# EasyEDA schematic My_Own_Arduino.json
TITLE: Dev Board; REV: 1.0; Date: 2020-12-23; Sheet: 1/1
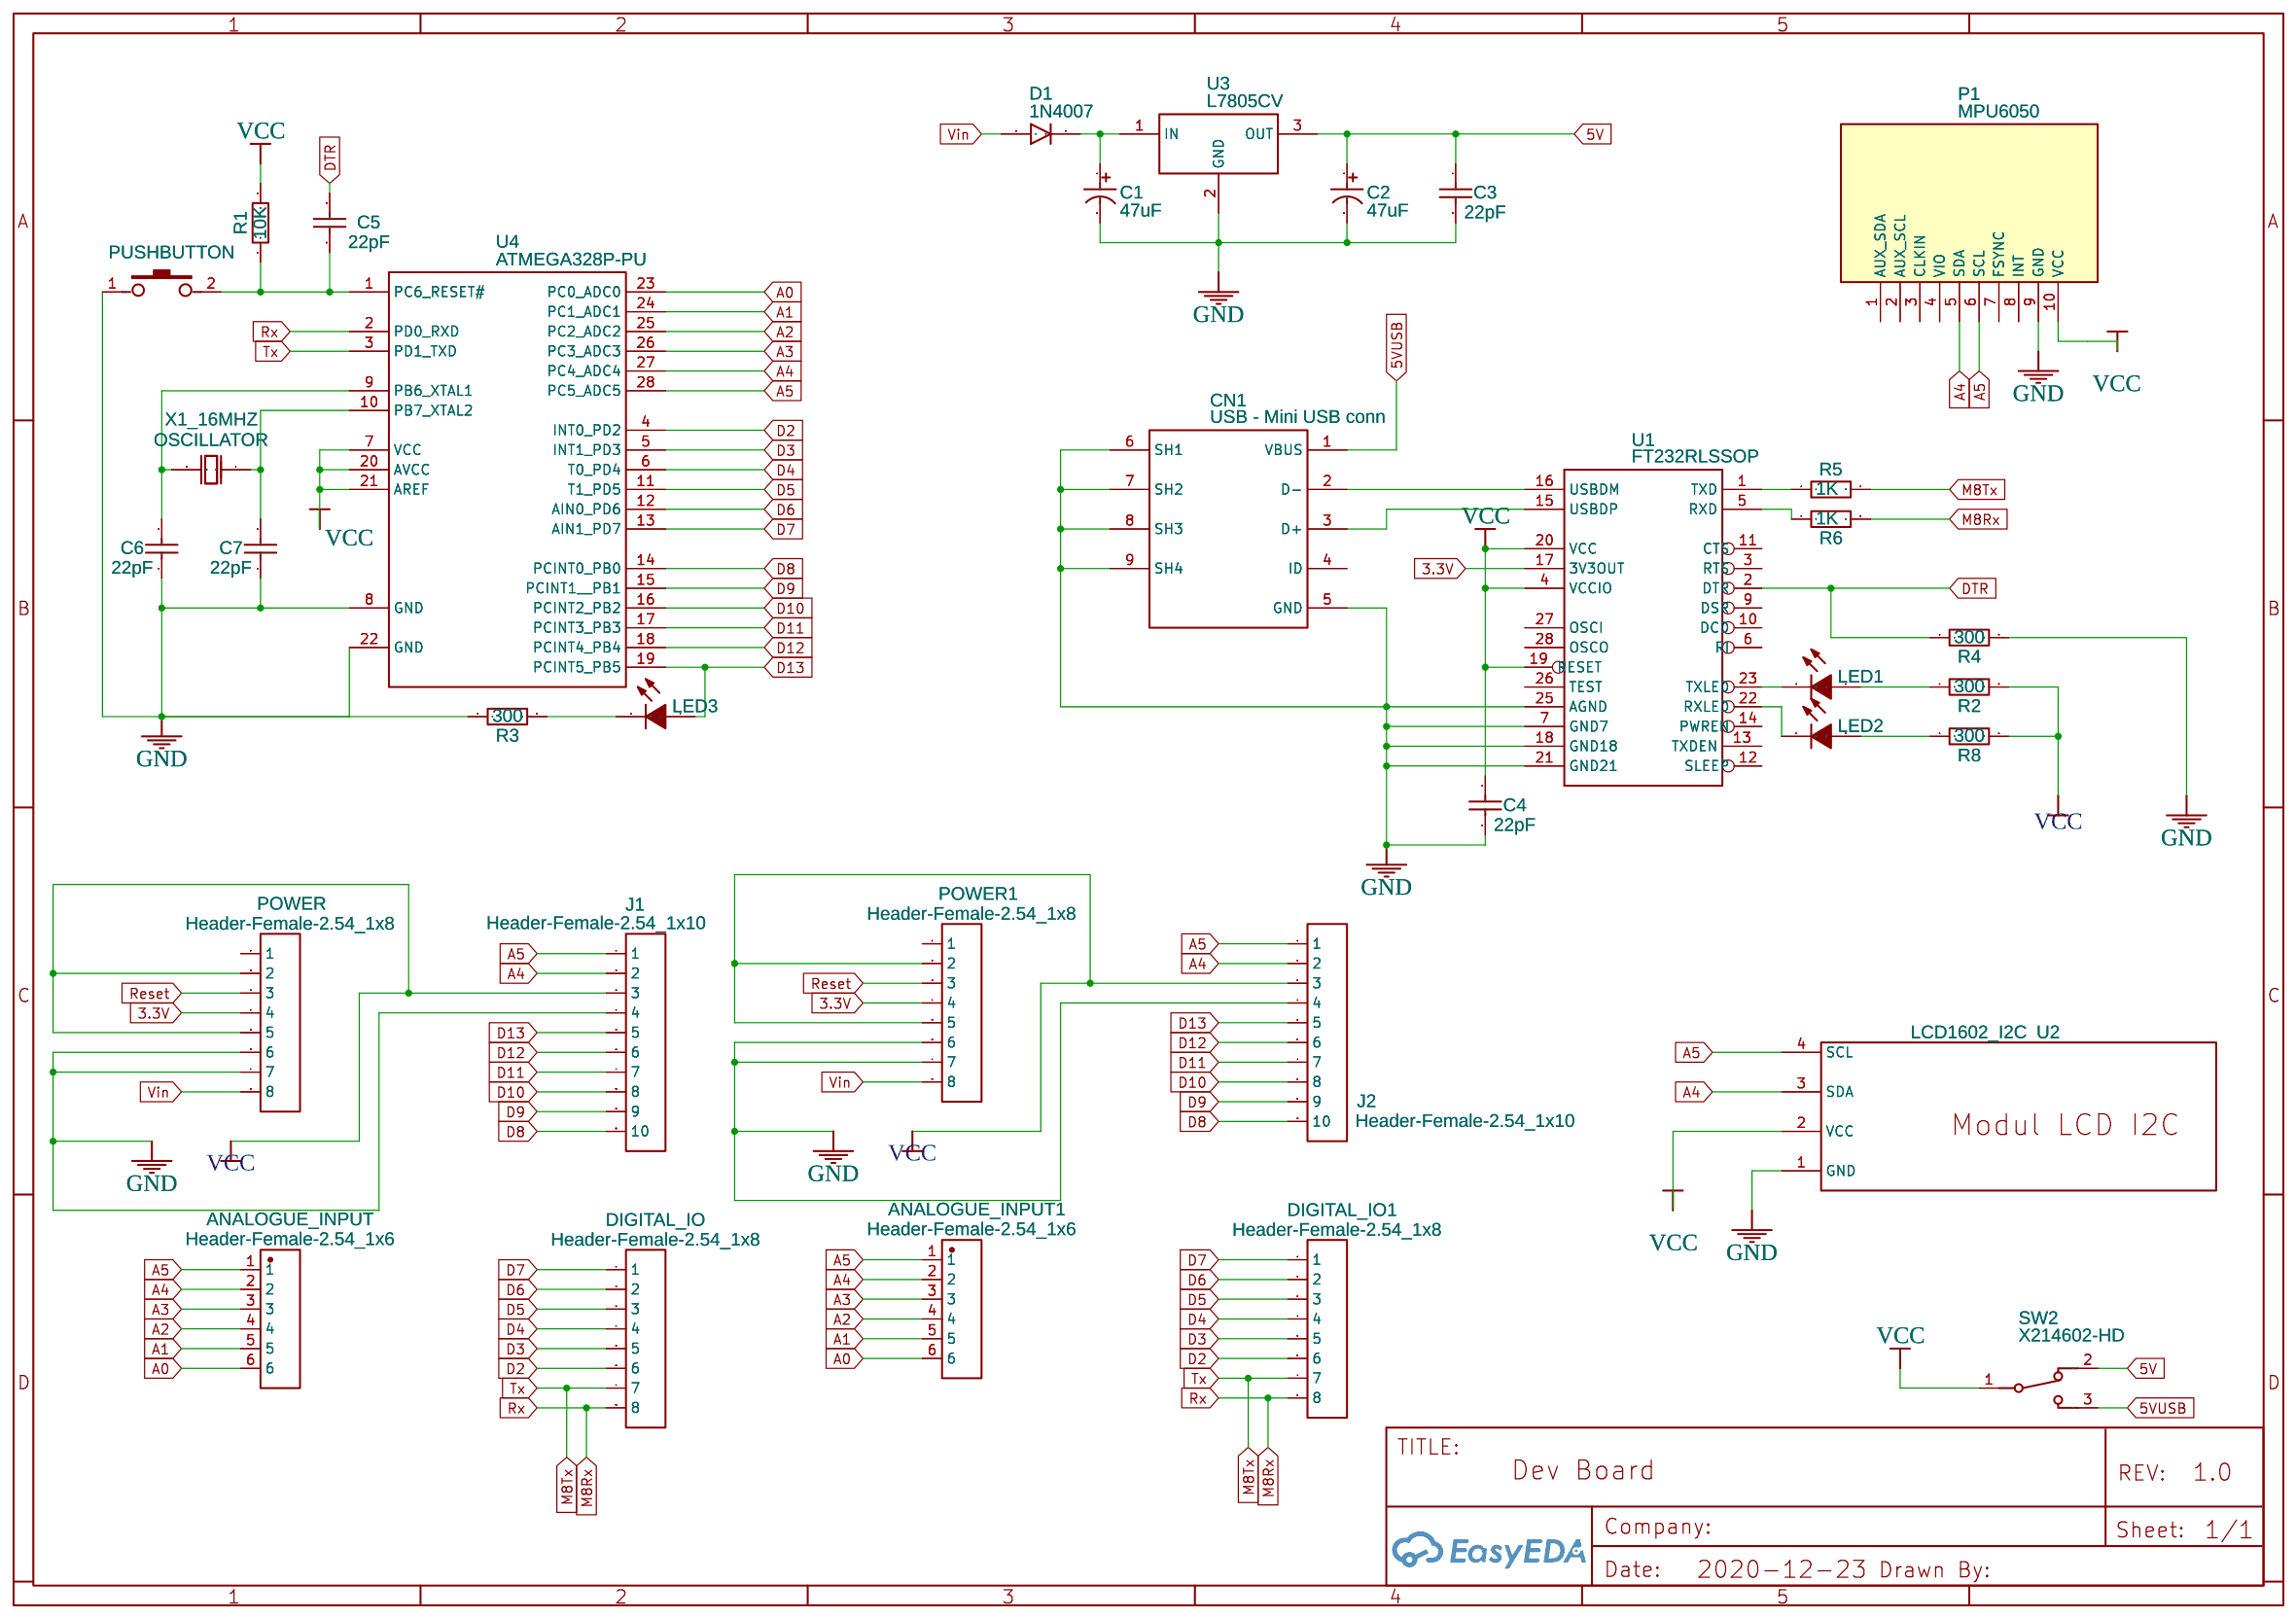
[diagram p0: schematic sheet]

## Parts
ANALOGUE_INPUT  Header-Female-2.54_1x6  [HDR-TH_6P-P2.54-V-F]
ANALOGUE_INPUT1  Header-Female-2.54_1x6  [HDR-TH_6P-P2.54-V-F]
C1  47uF  [CAP-D8.0XF3.5]
C2  47uF  [CAP-D8.0XF3.5]
C3  22pF  [CAP-TH_L5.0-W4.0-P5.00-D1.0]
C4  22pF  [CAP-TH_L5.0-W4.0-P5.00-D1.0]
C5  22pF  [CAP-TH_L5.0-W4.0-P5.00-D1.0]
C6  22pF  [CAP-TH_L5.0-W4.0-P5.00-D1.0]
C7  22pF  [CAP-TH_L5.0-W4.0-P5.00-D1.0]
CN1  USB - Mini USB conn  [MINI_USB_1.2_HOLE2]
D1  1N4007  [DO-41]
DIGITAL_IO  Header-Female-2.54_1x8  [HDR-TH_8P-P2.54-V]
DIGITAL_IO1  Header-Female-2.54_1x8  [HDR-TH_8P-P2.54-V]
J1  Header-Female-2.54_1x10  [HDR-TH_10P-P2.54-V-F]
J2  Header-Female-2.54_1x10  [HDR-TH_10P-P2.54-V-F]
LED1  XL-1.8SYT4AD  [LED3MM]
LED2  XL-1.8SYT4AD  [LED3MM]
LED3  XL-1.8SYT4AD  [LED3MM]
P1  MPU6050  [MPU6050]
POWER  Header-Female-2.54_1x8  [HDR-TH_8P-P2.54-V]
POWER1  Header-Female-2.54_1x8  [HDR-TH_8P-P2.54-V]
PUSHBUTTON  3X4MM TACT  [2 PIN SWITCH]
R1  10K  [RES-TH_BD1.9-L3.4-P7.40-D0.5]
R2  300  [RES-TH_BD2.2-L6.5-P10.50-D0.6]
R3  300  [RES-TH_BD2.2-L6.5-P10.50-D0.6]
R4  300  [RES-TH_BD2.2-L6.5-P10.50-D0.6]
R5  1K  [RES-TH_BD2.2-L6.5-P10.50-D0.6]
R6  1K  [RES-TH_BD2.2-L6.5-P10.50-D0.6]
R8  300  [RES-TH_BD2.2-L6.5-P10.50-D0.6]
SW2  X214602-HD  [SW-TH_X214602-HD]
U1  FT232RLSSOP  [SSOP28DB]
U2  LCD1602_I2C  [LCD1602 I2C]
U3  L7805CV  [TO-220-3_L10.0-W4.5-P2.54-L]
U4  ATMEGA328P-PU  [DIP-28_L34.6-W7.3-P2.54-LS10.2-BL]
X1_16MHZ  OSCILLATOR  [OSC]

## Library data of the parts
ANALOGUE_INPUT ANALOGUE_INPUT1 = Header-Female-2.54_1x6: Supplier: LCSC; Manufacturer: BOOMELE; Manufacturer Part: Female header 1*6p; Supplier Part: C40877
C1 C2 = 47uF: Voltage: 100V; Supplier Part: C47903; Supplier: LCSC; Manufacturer: ValuePro; Manufacturer Part: 47uF 100V 8*14Black high frequency
C3-C7 = Ceramic capacitors47PF 3KV: Supplier: LCSC; Manufacturer: ReliaPro; Supplier Part: C19375
CN1 = USB - Mini USB conn: Manufacturer Part: USB - Mini USB; link: https://www.es.co.th/Schemetic/PDF/MUMRB05FTKN.PDF; Contributor: suwanp
D1 = 1N4007: Supplier Part: C84641; Supplier: LCSC; Manufacturer: STARSEA; Contributor: Deimoss
DIGITAL_IO DIGITAL_IO1 POWER POWER1 = Header-Female-2.54_1x8: Supplier: LCSC; Manufacturer: BOOMELE; Manufacturer Part: Female headerHDR1X8-2.54; Supplier Part: C27438
J1 J2 = Header-Female-2.54_1x10: Supplier: LCSC; Manufacturer: BOOMELE; Manufacturer Part: 2.54mm 1*10P Straight Female header Gold-plated; Supplier Part: C35445
LED1-LED3 = XL-1.8SYT4AD: Supplier Part: undefined; Supplier: LCSC; Manufacturer: LCSC
P1 = MPU6050: sourceId: 1T5FDZYC8
PUSHBUTTON = 3X4MM TACT: Manufacturer: ReliaPro; Manufacturer Part: Switch3x4x2; Contributor: Shyam Ravi
R1 = MFR-12JT-52-10K: Supplier: LCSC; Supplier Part: C176374; Manufacturer: YAGEO; Contributor: LCSC
R2-R6 R8 = MFR0W4F3000A50: Supplier: LCSC; Manufacturer: UniOhm; Supplier Part: C58609
SW2 = X214602-HD: Supplier: LCSC; Supplier Part: C712702; Manufacturer: Honeywell; Contributor: LCSC
U1 = FT232RLSSOP: USB UART; Contributor: SparkFun
U2 = LCD1602_I2C: Manufacturer Part: LCD1602 i2c; Contributor: John2019
U3 = L7805CV: Supplier: LCSC; Manufacturer: STMicroelectronics; Supplier Part: C111887
U4 = ATMEGA328P-PU: sourceId: Oic6oiASL; Supplier: LCSC; Manufacturer: MICROCHIP; image: //image.lceda.cn/szlcsc/C33901.jpg; Contributor: LCSC; Supplier Part: C33901
X1_16MHZ = OSCILLATOR: Contributor: NUUT

## Nets
3.3V: POWER.4 POWER1.4 U1.17(3V3OUT)
5V: C2.1 C3.1 SW2.2 U3.3(OUT)
5VUSB: CN1.1(VBUS) SW2.3
GND: C1.2 C2.2 C3.2 C4.2 C6.2 C7.2 CN1.5(GND) CN1.6(SH1) CN1.7(SH2) CN1.8(SH3) CN1.9(SH4) J1.4 J2.4 P1.9(GND) POWER.6 POWER.7 POWER1.6 POWER1.7 PUSHBUTTON.1 R3.1 R4.2 U1.7(GND7) U1.18(GND18) U1.21(GND21) U1.25(AGND) U2.1(GND) U3.2(GND) U4.8(GND) U4.22(GND)
VCC: C4.1 J1.3 J2.3 P1.10(VCC) POWER.2 POWER.5 POWER1.2 POWER1.5 R1.1 R2.2 R8.2 SW2.1 U1.4(VCCIO) U1.19(RESET) U1.20(VCC) U2.2(VCC) U4.7(VCC) U4.20(AVCC) U4.21(AREF)
Vin: D1.1(A) POWER.8 POWER1.8
A0: ANALOGUE_INPUT.6 ANALOGUE_INPUT1.6 U4.23(PC0 ADC0)
A1: ANALOGUE_INPUT.5 ANALOGUE_INPUT1.5 U4.24(PC1 ADC1)
A2: ANALOGUE_INPUT.4 ANALOGUE_INPUT1.4 U4.25(PC2 ADC2)
A3: ANALOGUE_INPUT.3 ANALOGUE_INPUT1.3 U4.26(PC3 ADC3)
A4: ANALOGUE_INPUT.2 ANALOGUE_INPUT1.2 J1.2 J2.2 P1.5(SDA) U2.3(SDA) U4.27(PC4 ADC4)
A5: ANALOGUE_INPUT.1 ANALOGUE_INPUT1.1 J1.1 J2.1 P1.6(SCL) U2.4(SCL) U4.28(PC5 ADC5)
D2: DIGITAL_IO.6 DIGITAL_IO1.6 U4.4(INT0 PD2)
D3: DIGITAL_IO.5 DIGITAL_IO1.5 U4.5(INT1 PD3)
D4: DIGITAL_IO.4 DIGITAL_IO1.4 U4.6(T0 PD4)
D5: DIGITAL_IO.3 DIGITAL_IO1.3 U4.11(T1 PD5)
D6: DIGITAL_IO.2 DIGITAL_IO1.2 U4.12(AIN0 PD6)
D7: DIGITAL_IO.1 DIGITAL_IO1.1 U4.13(AIN1 PD7)
D8: J1.10 J2.10 U4.14(PCINT0 PB0)
D9: J1.9 J2.9 U4.15(PCINT1  PB1)
D10: J1.8 J2.8 U4.16(PCINT2 PB2)
D11: J1.7 J2.7 U4.17(PCINT3 PB3)
D12: J1.6 J2.6 U4.18(PCINT4 PB4)
D13: J1.5 J2.5 LED3.1(A) U4.19(PCINT5 PB5)
DTR: C5.1 R4.1 U1.2(DTR)
M8Rx: DIGITAL_IO.8 DIGITAL_IO1.8 R6.2 U4.2(PD0 RXD)
M8Tx: DIGITAL_IO.7 DIGITAL_IO1.7 R5.2 U4.3(PD1 TXD)
Reset: POWER.3 POWER1.3
Net-(C1-1): C1.1 D1.2(C) U3.1(IN)
Net-(C5-2): C5.2 PUSHBUTTON.2 R1.2 U4.1(PC6 RESET#)
Net-(C6-1): C6.1 U4.9(PB6 XTAL1) X1_16MHZ.2(OSC2)
Net-(C7-1): C7.1 U4.10(PB7 XTAL2) X1_16MHZ.1(OSC1)
Net-(CN1-2): CN1.2(D-) U1.16(USBDM)
Net-(CN1-3): CN1.3(D+) U1.15(USBDP)
Net-(LED1-1): LED1.1(A) R2.1
Net-(LED1-2): LED1.2(C) U1.23(TXLED)
Net-(LED2-1): LED2.1(A) R8.1
Net-(LED2-2): LED2.2(C) U1.22(RXLED)
Net-(LED3-2): LED3.2(C) R3.2
Net-(R5-1): R5.1 U1.1(TXD)
Net-(R6-1): R6.1 U1.5(RXD)

Not connected (* = marked no-connect by the designer): CN1 4(ID); P1 1(AUX_SDA) 2(AUX_SCL) 3(CLKIN) 4(VIO) 7(FSYNC) 8(INT); POWER 1; POWER1 1; U1 3(RTS) 6(RI) 9(DSR) 10(DCD) 11(CTS) 12(SLEEP) 13(TXDEN) 14(PWREN) 26(TEST) 27(OSCI) 28(OSCO)
